# Altium schematic sheet 电源.SchDoc
size A4
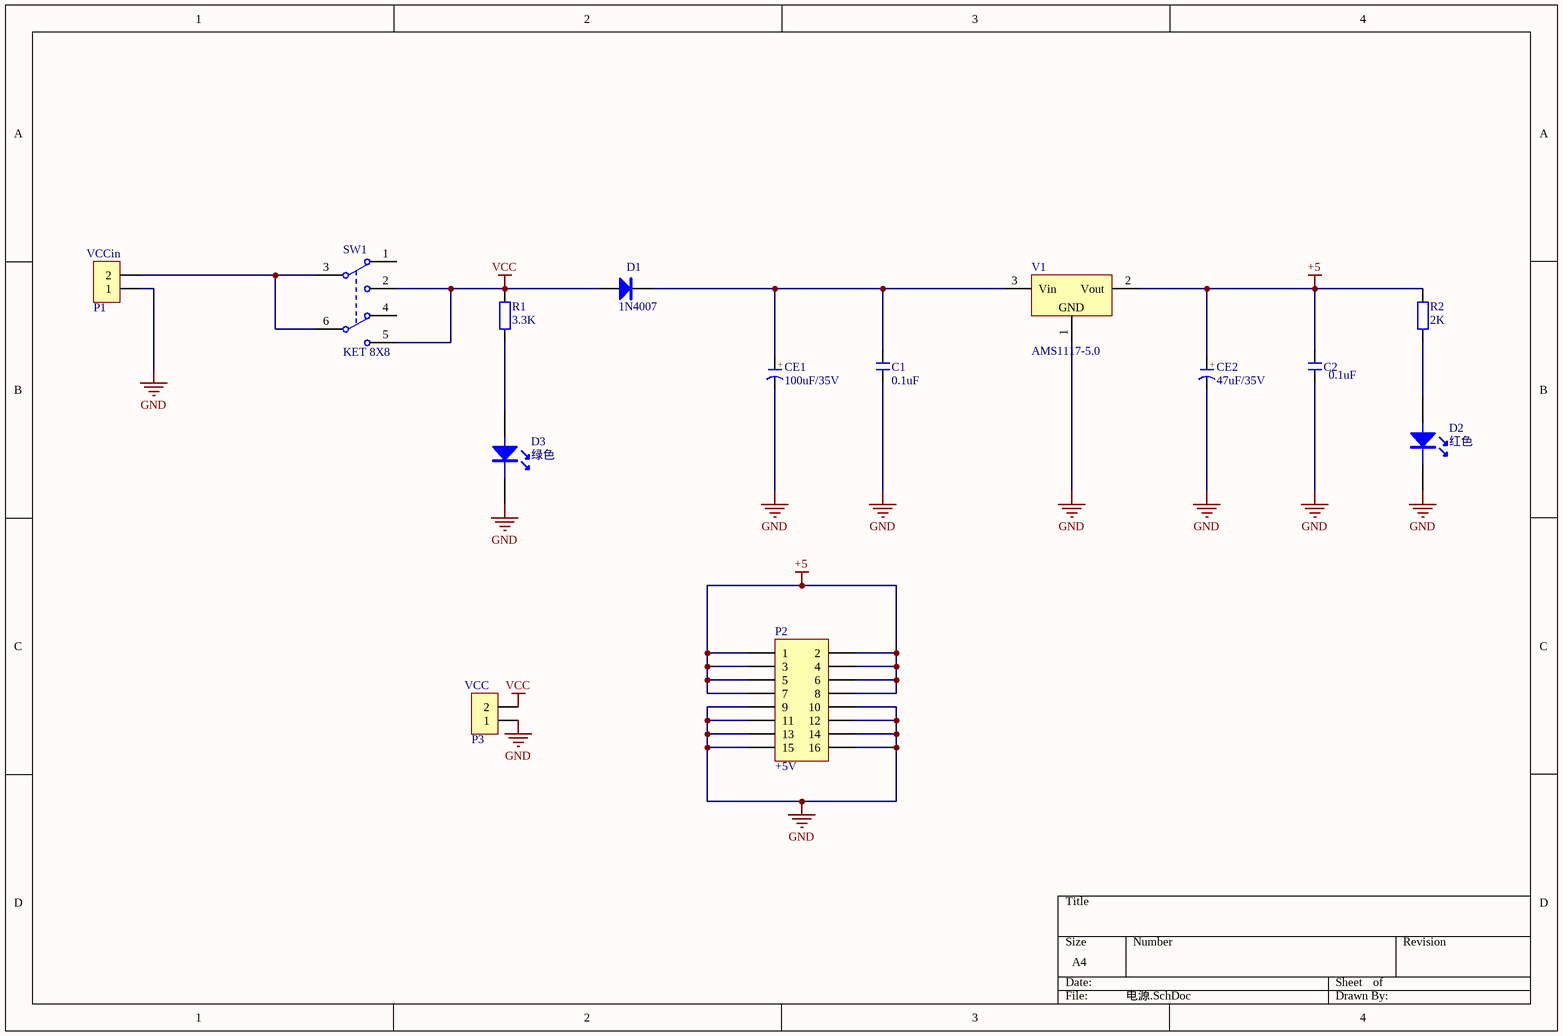
[diagram p0: 电源.SchDoc]

## Parts
C1  0.1uF  [C 0805_L]
C2  0.1uF  [C 0805_L]
CE1  100uF/35V  [RAD0.1]
CE2  47uF/35V  [RAD0.1]
D1  1N4007  [SOD-123]
D2  红色  [LED 1206R]
D3  绿色  [LED 1206G]
P1  HDR-1X2  [MX 1.25-WI-2P]  (value not drawn)
P2  +5V  [HDR2X8]
P3  HDR-1X2  [MX 1.25-WI-2P]  (value not drawn)
R1  3.3K  [R 0805_L]
R2  2K  [R 0201_L]
SW1  KET 8X8  [KFT DIP-8X8]
V1  AMS1117-5.0  [SOT223_L]

## Nets
+5: C2.2 CE2.1(A) P2.1 P2.2 P2.3 P2.4 P2.5 P2.6 P2.7 P2.8 R2.2 V1.2(Vout)
GND: C1.1 C2.1 CE1.2(K) CE2.2(K) D2.K D3.K P1.1 P2.9 P2.10 P2.11 P2.12 P2.13 P2.14 P2.15 P2.16 P3.1 V1.1(GND)
VCC: D1.1(A) P3.2 R1.2 SW1.2(COM2) SW1.5(COM2)
NetC1_2: C1.2 CE1.1(A) D1.2(K) V1.3(Vin)
NetD2_A: D2.A R2.1
NetD3_A: D3.A R1.1
NetP1_2: P1.2 SW1.3(NO1) SW1.6(NC2)

Not connected (* = marked no-connect by the designer): SW1 1(NC1) 4(NO2)

## Notes on the sheet
- (near P1) VCCin
- (near P3) VCC
- (in symbol CE) +

## Library data of the parts
C1 C2 = C: 贴片电容; BOM名称: 无极性贴片电容; 淘宝ID: 封装库来自淘宝 ID：黄晶宝石; 联系售后，技术支持: https://shop463601444.taobao.com; 唯一出售店铺网址: https://shop463601444.taobao.com
CE1 CE2 = CE: 直插电解电容; 淘宝ID: 封装库来自淘宝 ID：黄晶宝石; BOM名称: 直插电解电容; 联系售后: https://shop463601444.taobao.com
D1 = 1N4007: 整流二极管; 淘宝ID: 封装库来自淘宝 ID：黄晶宝石; 封装库来自淘宝卖家 ID：黄晶宝石: 其他店铺购入均为盗版，不享受售后技术支持服务，请立即申请退款; BOM名称: 整流二极管; 联系售后，技术支持: https://shop463601444.taobao.com
D2 D3 = 发光二极管: LED; 联系售后，技术支持: 封装库来自淘宝 ID：黄晶宝石
P1 P3 = Header 2: 2P接插件; 版权归属: 封装库来自淘宝 ID：黄晶宝石; 技术支持，联系售后: 封装库来自淘宝卖家 ID：黄晶宝石; BOM名称: 2P接插件; 联系售后: https://shop463601444.taobao.com
P2 = Header 8X2: Header, 8-Pin, Dual row; LatestRevisionDate: 17-Jul-2002; LatestRevisionNote: Re-released for DXP Platform.; Publisher: Altium Limited
R1 R2 = R: 贴片电阻; 版权归属: 来自淘宝 ID：黄晶宝石; 封装库来自淘宝卖家 ID：黄晶宝石: 其他店铺购入均为盗版，不享受售后技术支持服务，请立即申请退款; BOM名称: 贴片电阻; 联系售后: https://shop463601444.taobao.com
SW1 = KET 8X8: 8*8自锁开关; 版权归属: 封装库来自淘宝 ID：黄晶宝石; BOM名称: 8*8自锁开关; 学习资源: https://shop463601444.taobao.com
V1 = AMS1117: 三端稳压芯片; BOM名称: 稳压芯片; 淘宝ID: 封装库来自淘宝 ID：黄晶宝石; 欢迎光临淘宝店铺: https://shop463601444.taobao.com